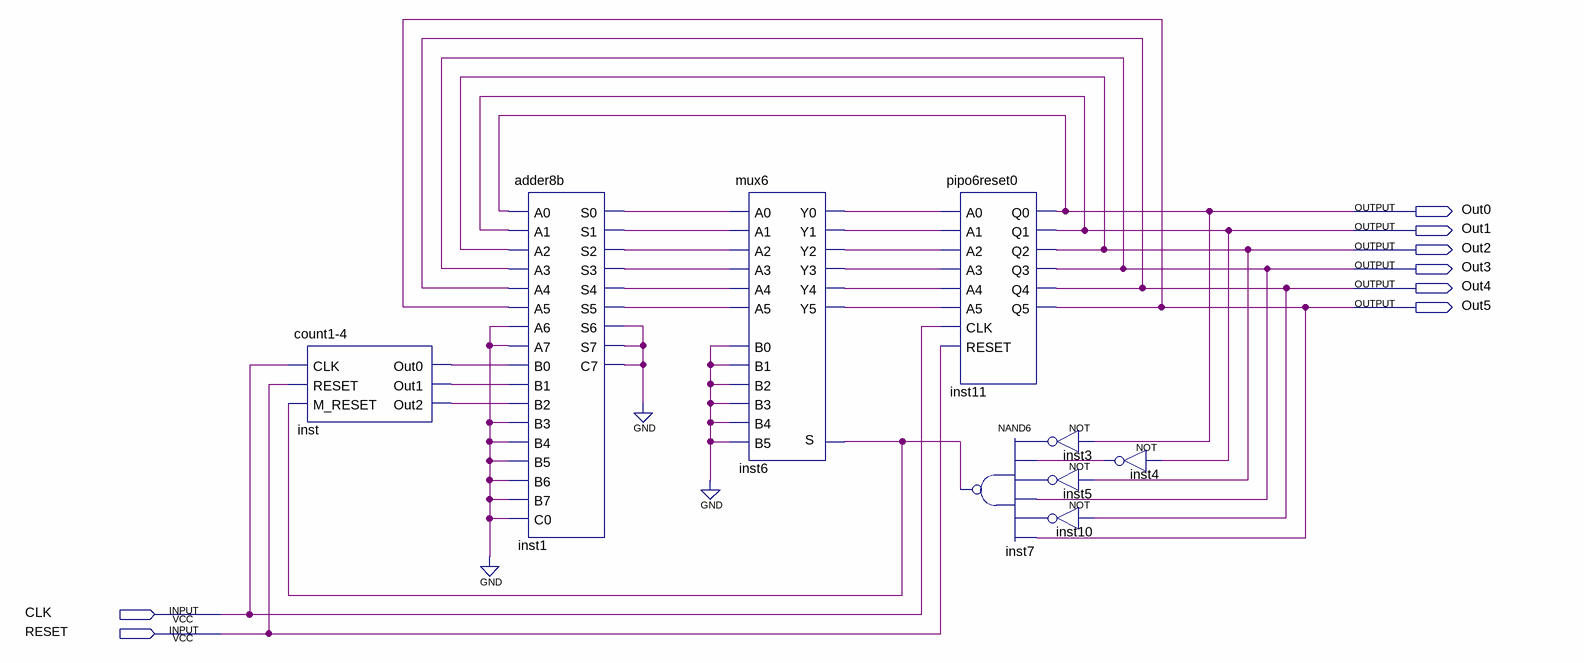
[diagram p0: schematic sheet]
// Quartus schematic LAB2-LUN-P1.bdf as structural Verilog: 9 symbols, 8 pins
module \LAB2-LUN-P1  (
  input  CLK,
  input  RESET,
  output Out0,
  output Out1,
  output Out2,
  output Out3,
  output Out4,
  output Out5
);

  wire inst1_s0, inst1_s1, inst1_s2, inst1_s3, inst1_s4, inst1_s5, inst1_s6, inst3_out, inst4_out, inst5_out,
       inst6_y0, inst6_y1, inst6_y2, inst6_y3, inst6_y4, inst6_y5, inst7_out, inst10_out, inst_out0,
       inst_out1, inst_out2;

  \count1-4  inst (.CLK(CLK), .RESET(RESET), .M_RESET(inst7_out), .Out0(inst_out0), .Out1(inst_out1), .Out2(inst_out2));
  adder8b inst1 (
    .A0(Out0), .A1(Out1), .A2(Out2), .A3(Out3), .A4(Out4), .A5(Out5), .A6(1'b0), .A7(1'b0), .B0(inst_out0),
    .B1(inst_out1), .B2(inst_out2), .B3(1'b0), .B4(1'b0), .B5(1'b0), .B6(1'b0), .B7(1'b0), .C0(1'b0),
    .S0(inst1_s0), .S1(inst1_s1), .S2(inst1_s2), .S3(inst1_s3), .S4(inst1_s4), .S5(inst1_s5), .S6(inst1_s6),
    .S7(inst1_s6), .C7(inst1_s6));
  mux6 inst6 (
    .A0(inst1_s0), .A1(inst1_s1), .A2(inst1_s2), .A3(inst1_s3), .A4(inst1_s4), .B0(1'b0), .B1(1'b0),
    .B2(1'b0), .B3(1'b0), .B4(1'b0), .S(inst7_out), .B5(1'b0), .A5(inst1_s5), .Y0(inst6_y0), .Y1(inst6_y1),
    .Y2(inst6_y2), .Y3(inst6_y3), .Y4(inst6_y4), .Y5(inst6_y5));
  pipo6reset0 inst11 (
    .CLK(CLK), .RESET(RESET), .A2(inst6_y2), .A0(inst6_y0), .A1(inst6_y1), .A3(inst6_y3), .A4(inst6_y4),
    .A5(inst6_y5), .Q0(Out0), .Q1(Out1), .Q2(Out2), .Q3(Out3), .Q4(Out4), .Q5(Out5));
  nand inst7 (inst7_out, inst3_out, inst4_out, inst5_out, Out3, inst10_out, Out5);
  not inst3 (inst3_out, Out0);
  not inst5 (inst5_out, Out2);
  not inst10 (inst10_out, Out4);
  not inst4 (inst4_out, Out1);
  // also tied to GND on the sheet: inst1_s6
endmodule
